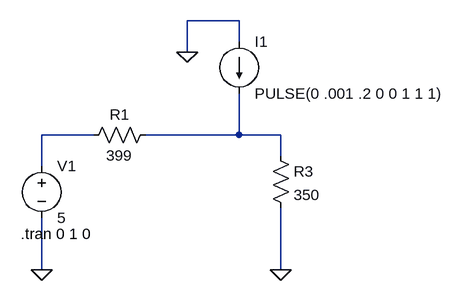
[diagram p0: schematic 2022-11-30_Voltage_Divider2.asc]
2022-11-30_Voltage_Divider2.asc, the LTspice schematic file:
Version 4
SHEET 1 880 680
WIRE 384 -16 304 -16
WIRE 384 16 384 -16
WIRE 304 32 304 -16
WIRE 160 160 80 160
WIRE 384 160 384 96
WIRE 384 160 240 160
WIRE 448 160 384 160
WIRE 448 192 448 160
WIRE 80 208 80 160
WIRE 80 368 80 288
WIRE 448 368 448 272
FLAG 80 368 0
FLAG 304 32 0
FLAG 448 368 0
SYMBOL voltage 80 192 R0
WINDOW 123 0 0 Left 0
WINDOW 39 24 124 Left 2
SYMATTR InstName V1
SYMATTR Value 5
SYMBOL res 432 176 R0
SYMATTR InstName R3
SYMATTR Value 350
SYMBOL res 144 176 R270
WINDOW 0 32 56 VTop 2
WINDOW 3 0 56 VBottom 2
SYMATTR InstName R1
SYMATTR Value 399
SYMBOL current 384 16 R0
WINDOW 123 0 0 Left 0
WINDOW 39 0 0 Left 0
SYMATTR InstName I1
SYMATTR Value PULSE(0 .001 .2 0 0 1 1 1)
TEXT 48 312 Left 2 !.tran 0 1 0

The netlist it stands for:
* 2022-11-30_Voltage_Divider2.asc
V1 N001 0 5
R3 N002 0 350
R1 N001 N002 399
I1 0 N002 PULSE(0 .001 .2 0 0 1 1 1)
.tran 0 1 0
.backanno
.end